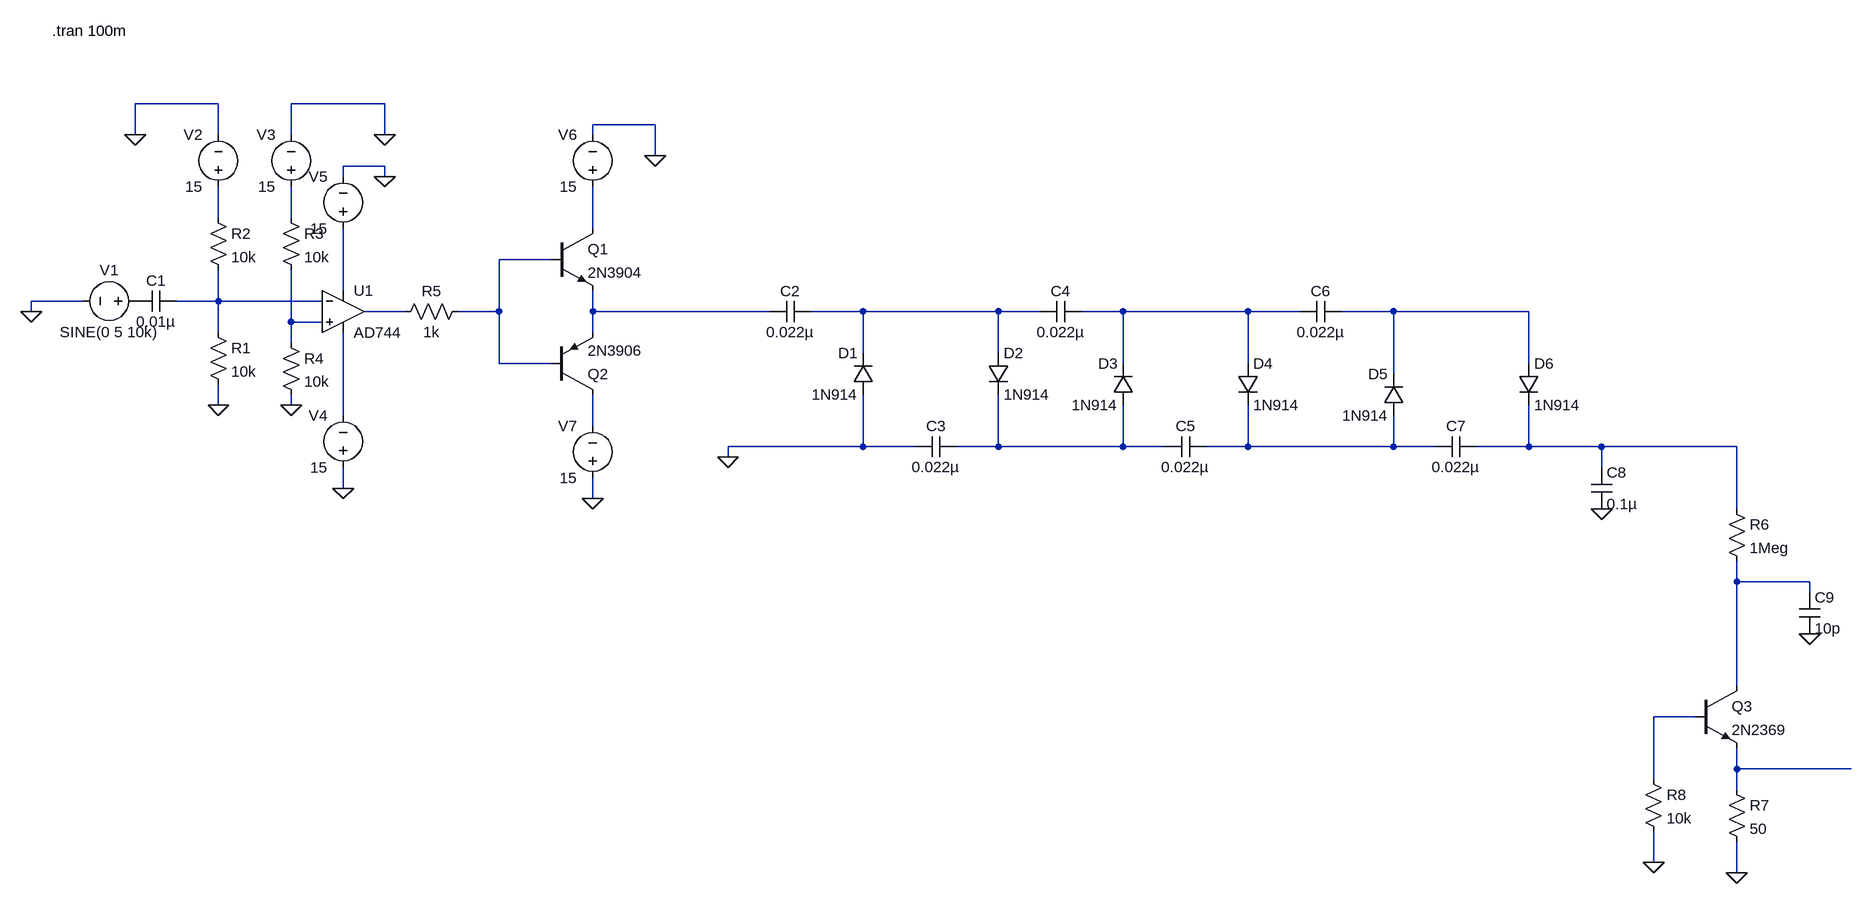
[diagram p0: schematic Boost_Circuit.asc]
Boost_Circuit.asc, the LTspice schematic file:
Version 4
SHEET 1 2628 1152
WIRE 112 -48 -16 -48
WIRE 368 -48 224 -48
WIRE 784 -16 688 -16
WIRE -16 0 -16 -48
WIRE 112 0 112 -48
WIRE 224 0 224 -48
WIRE 368 0 368 -48
WIRE 688 0 688 -16
WIRE 784 32 784 -16
WIRE 368 48 304 48
WIRE 304 64 304 48
WIRE 368 64 368 48
WIRE 112 128 112 80
WIRE 224 128 224 80
WIRE 688 144 688 80
WIRE 624 192 544 192
WIRE 304 240 304 144
WIRE -96 256 -176 256
WIRE 112 256 112 208
WIRE 112 256 48 256
WIRE 272 256 112 256
WIRE -176 272 -176 256
WIRE 400 272 336 272
WIRE 544 272 544 192
WIRE 544 272 480 272
WIRE 688 272 688 240
WIRE 960 272 688 272
WIRE 1104 272 1024 272
WIRE 1312 272 1104 272
WIRE 1376 272 1312 272
WIRE 1504 272 1440 272
WIRE 1696 272 1504 272
WIRE 1776 272 1696 272
WIRE 1920 272 1840 272
WIRE 2128 272 1920 272
WIRE 224 288 224 208
WIRE 272 288 224 288
WIRE 112 304 112 256
WIRE 688 304 688 272
WIRE 224 320 224 288
WIRE 1104 336 1104 272
WIRE 1312 336 1312 272
WIRE 544 352 544 272
WIRE 624 352 544 352
WIRE 1504 352 1504 272
WIRE 1696 352 1696 272
WIRE 2128 352 2128 272
WIRE 1920 368 1920 272
WIRE 112 416 112 384
WIRE 224 416 224 400
WIRE 304 432 304 304
WIRE 688 448 688 400
WIRE 1104 480 1104 400
WIRE 1104 480 896 480
WIRE 1184 480 1104 480
WIRE 1312 480 1312 400
WIRE 1312 480 1248 480
WIRE 1504 480 1504 416
WIRE 1504 480 1312 480
WIRE 1568 480 1504 480
WIRE 1696 480 1696 416
WIRE 1696 480 1632 480
WIRE 1920 480 1920 432
WIRE 1920 480 1696 480
WIRE 1984 480 1920 480
WIRE 2128 480 2128 416
WIRE 2128 480 2048 480
WIRE 2240 480 2128 480
WIRE 2448 480 2240 480
WIRE 896 496 896 480
WIRE 2240 512 2240 480
WIRE 304 544 304 512
WIRE 688 560 688 528
WIRE 2448 576 2448 480
WIRE 2448 688 2448 656
WIRE 2560 688 2448 688
WIRE 2560 704 2560 688
WIRE 2448 848 2448 688
WIRE 2384 896 2320 896
WIRE 2448 976 2448 944
WIRE 2624 976 2448 976
WIRE 2320 992 2320 896
WIRE 2448 1008 2448 976
WIRE 2320 1120 2320 1072
WIRE 2448 1136 2448 1088
FLAG 112 416 0
FLAG -16 0 0
FLAG 368 0 0
FLAG 224 416 0
FLAG 368 64 0
FLAG 304 544 0
FLAG -176 272 0
FLAG 784 32 0
FLAG 688 560 0
FLAG 896 496 0
FLAG 2448 1136 0
FLAG 2320 1120 0
FLAG 2560 768 0
FLAG 2240 576 0
SYMBOL Voltage 0 256 R90
WINDOW 0 -32 56 VBottom 2
WINDOW 3 32 56 VTop 2
SYMATTR InstName V1
SYMATTR Value SINE(0 5 10k)
SYMBOL Cap 48 240 R90
WINDOW 0 0 32 VBottom 2
WINDOW 3 32 32 VTop 2
SYMATTR InstName C1
SYMATTR Value 0.01µ
SYMBOL Res 96 288 R0
SYMATTR InstName R1
SYMATTR Value 10k
SYMBOL OpAmps/AD744 304 208 R0
SYMATTR InstName U1
SYMBOL Res 96 112 R0
SYMATTR InstName R2
SYMATTR Value 10k
SYMBOL Voltage 112 96 R180
WINDOW 0 24 96 Left 2
WINDOW 3 24 16 Left 2
SYMATTR InstName V2
SYMATTR Value 15
SYMBOL Voltage 224 96 R180
WINDOW 0 24 96 Left 2
WINDOW 3 24 16 Left 2
SYMATTR InstName V3
SYMATTR Value 15
SYMBOL Res 208 112 R0
SYMATTR InstName R3
SYMATTR Value 10k
SYMBOL Res 208 304 R0
SYMATTR InstName R4
SYMATTR Value 10k
SYMBOL Voltage 304 528 R180
WINDOW 0 24 96 Left 2
WINDOW 3 24 16 Left 2
SYMATTR InstName V4
SYMATTR Value 15
SYMBOL Voltage 304 160 R180
WINDOW 0 24 96 Left 2
WINDOW 3 24 16 Left 2
SYMATTR InstName V5
SYMATTR Value 15
SYMBOL npn 624 144 R0
SYMATTR InstName Q1
SYMATTR Value 2N3904
SYMBOL pnp 624 400 M180
SYMATTR InstName Q2
SYMATTR Value 2N3906
SYMBOL Voltage 688 96 R180
WINDOW 0 24 96 Left 2
WINDOW 3 24 16 Left 2
SYMATTR InstName V6
SYMATTR Value 15
SYMBOL Res 496 256 R90
WINDOW 0 0 56 VBottom 2
WINDOW 3 32 56 VTop 2
SYMATTR InstName R5
SYMATTR Value 1k
SYMBOL Voltage 688 544 R180
WINDOW 0 24 96 Left 2
WINDOW 3 24 16 Left 2
SYMATTR InstName V7
SYMATTR Value 15
SYMBOL Cap 1024 256 R90
WINDOW 0 0 32 VBottom 2
WINDOW 3 32 32 VTop 2
SYMATTR InstName C2
SYMATTR Value 0.022µ
SYMBOL diode 1120 400 R180
WINDOW 0 24 64 Left 2
WINDOW 3 24 0 Left 2
SYMATTR InstName D1
SYMATTR Value 1N914
SYMBOL Cap 1248 464 R90
WINDOW 0 0 32 VBottom 2
WINDOW 3 32 32 VTop 2
SYMATTR InstName C3
SYMATTR Value 0.022µ
SYMBOL diode 1296 336 R0
SYMATTR InstName D2
SYMATTR Value 1N914
SYMBOL Cap 1440 256 R90
WINDOW 0 0 32 VBottom 2
WINDOW 3 32 32 VTop 2
SYMATTR InstName C4
SYMATTR Value 0.022µ
SYMBOL diode 1520 416 R180
WINDOW 0 24 64 Left 2
WINDOW 3 24 0 Left 2
SYMATTR InstName D3
SYMATTR Value 1N914
SYMBOL Cap 1632 464 R90
WINDOW 0 0 32 VBottom 2
WINDOW 3 32 32 VTop 2
SYMATTR InstName C5
SYMATTR Value 0.022µ
SYMBOL diode 1680 352 R0
SYMATTR InstName D4
SYMATTR Value 1N914
SYMBOL Cap 1840 256 R90
WINDOW 0 0 32 VBottom 2
WINDOW 3 32 32 VTop 2
SYMATTR InstName C6
SYMATTR Value 0.022µ
SYMBOL diode 1936 432 R180
WINDOW 0 24 64 Left 2
WINDOW 3 24 0 Left 2
SYMATTR InstName D5
SYMATTR Value 1N914
SYMBOL Cap 2048 464 R90
WINDOW 0 0 32 VBottom 2
WINDOW 3 32 32 VTop 2
SYMATTR InstName C7
SYMATTR Value 0.022µ
SYMBOL diode 2112 352 R0
SYMATTR InstName D6
SYMATTR Value 1N914
SYMBOL Cap 2224 512 R0
SYMATTR InstName C8
SYMATTR Value 0.1µ
SYMBOL Res 2432 560 R0
SYMATTR InstName R6
SYMATTR Value 1Meg
SYMBOL Cap 2544 704 R0
SYMATTR InstName C9
SYMATTR Value 10p
SYMBOL npn 2384 848 R0
SYMATTR InstName Q3
SYMATTR Value 2N2369
SYMBOL Res 2432 992 R0
SYMATTR InstName R7
SYMATTR Value 50
SYMBOL Res 2304 976 R0
SYMATTR InstName R8
SYMATTR Value 10k
TEXT -144 -160 Left 2 !.tran 100m

The netlist it stands for:
* Boost_Circuit.asc
V1 P001 0 SINE(0 5 10k)
C1 N006 P001 0.01µ
R1 N006 0 10k
XU1 N012 N006 N005 N013 N007 AD744  ; pins In+ In- V+ V- OUT
R2 N001 N006 10k
V2 N001 0 15
V3 N002 0 15
R3 N002 N012 10k
R4 N012 0 10k
V4 0 N013 15
V5 N005 0 15
Q1 N003 N004 N008 0 2N3904
Q2 N014 N004 N008 0 2N3906
V6 N003 0 15
R5 N004 N007 1k
V7 0 N014 15
C2 N009 N008 0.022µ
D1 0 N009 1N914
C3 N015 0 0.022µ
D2 N009 N015 1N914
C4 N010 N009 0.022µ
D3 N015 N010 1N914
C5 N016 N015 0.022µ
D4 N010 N016 1N914
C6 N011 N010 0.022µ
D5 N016 N011 1N914
C7 N017 N016 0.022µ
D6 N011 N017 1N914
C8 N017 0 0.1µ
R6 N017 N018 1Meg
C9 N018 0 10p
Q3 N018 N019 N020 0 2N2369
R7 N020 0 50
R8 N019 0 10k
.model D D
.lib standard.dio
.model NPN NPN
.model PNP PNP
.lib standard.bjt
.tran 100m
.backanno
.end